# EAGLE design Koala_Bear (EAGLE 6.5.0)
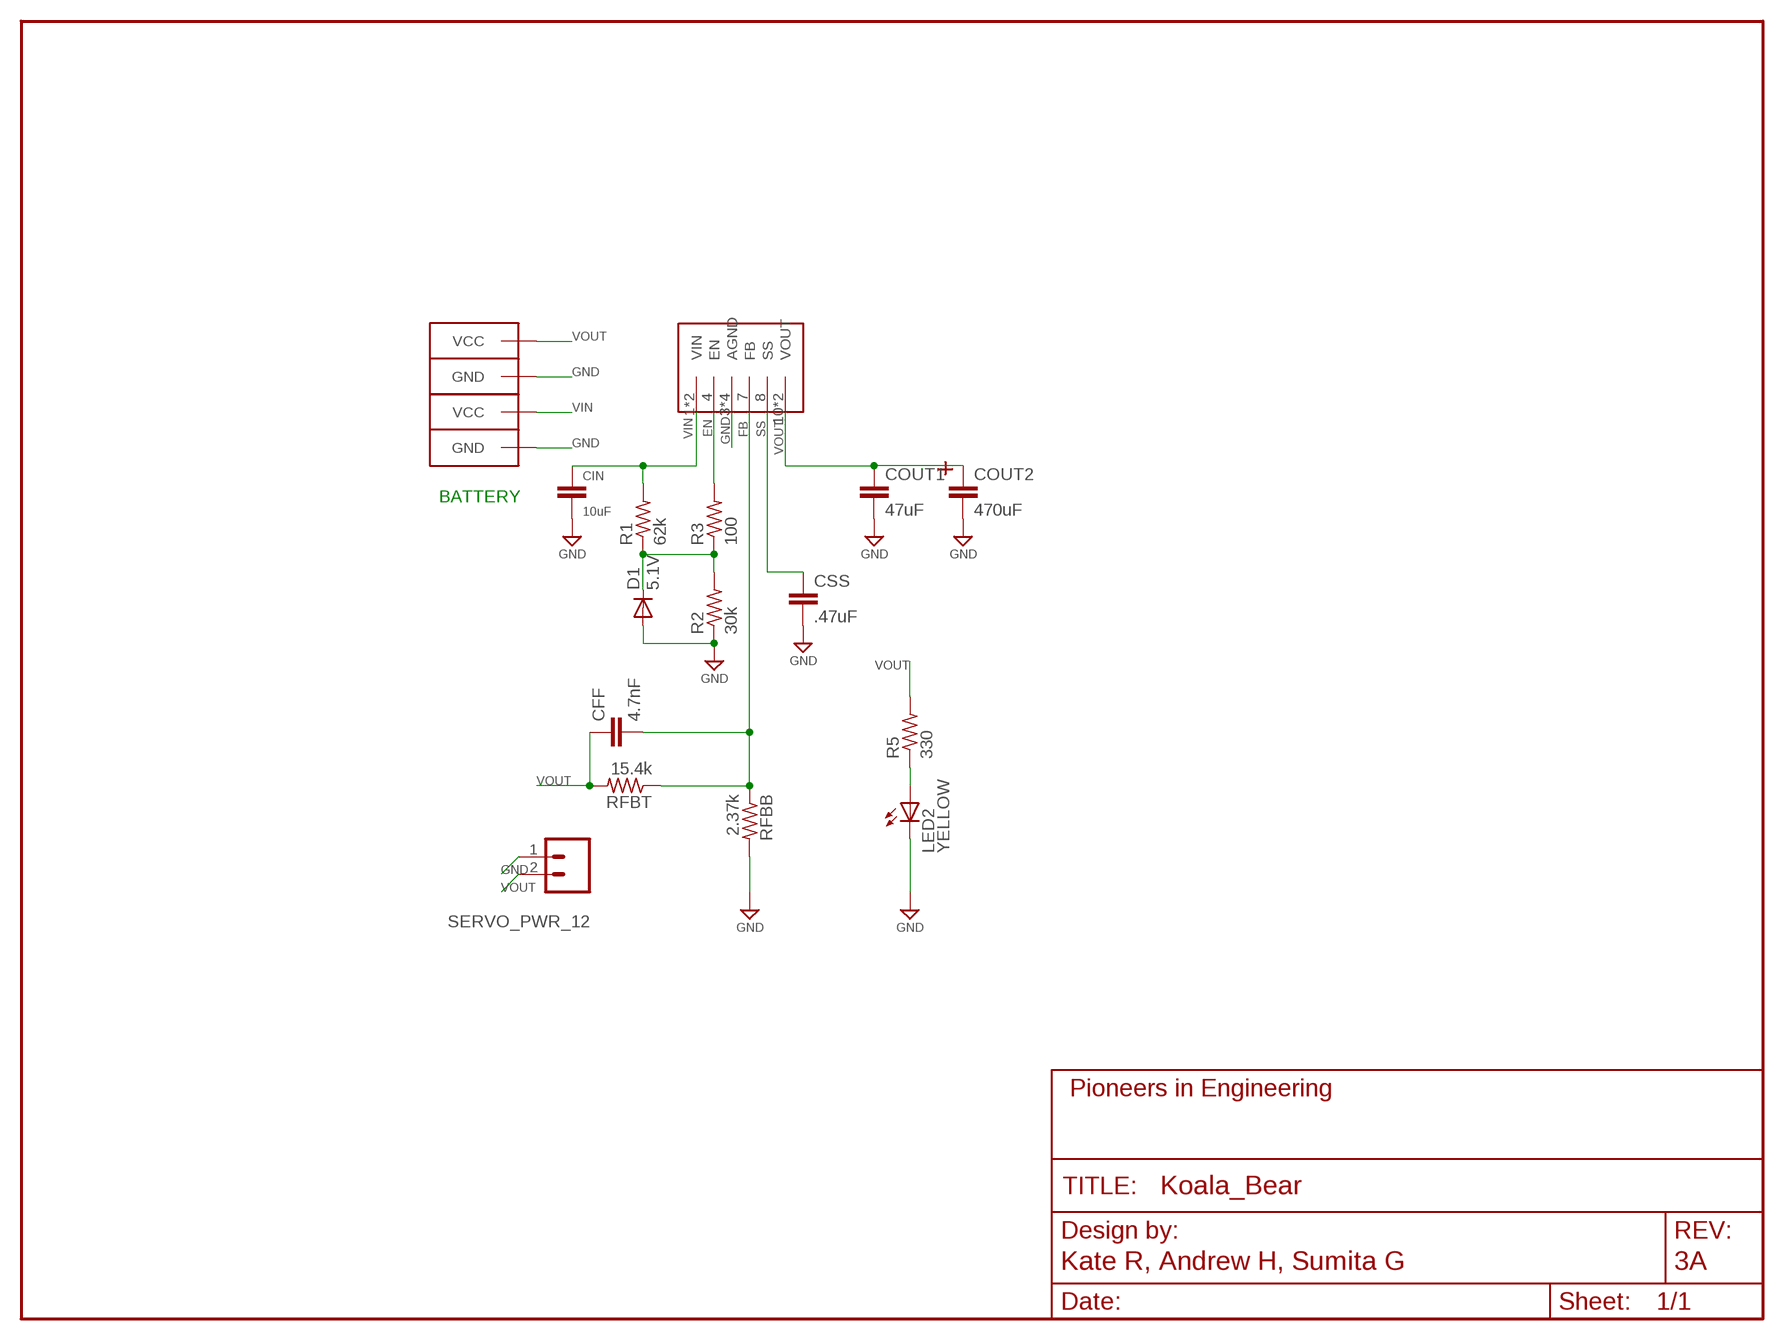
[diagram p0: schematic, sheet 1]
FRAME1 (FRAME-LETTER): AUTHOR: Kate R, Andrew H, Sumita G; REVISION: 3A

## Parts
CFF  4.7nF  CAP0603-CAP  [0603-CAP]
CIN  10uF  CAP1206  [1206]
COUT1  47uF  CAP1206  [1206]
COUT2  470uF  TANT_CASE_E  [TANT_CASE_E]
CSS  .47uF  CAP0603-CAP  [0603-CAP]
D1  5.1V  DIODESOD-323  [SOD-323]
LED2  YELLOW  LED0805  [LED-0805]
PWR  ANDERSONVERTICAL  [ANDERSON_VERTICAL]
PWR1  ANDERSONVERTICAL  [ANDERSON_VERTICAL]
R1  62k  R-US_R0603  [R0603]
R2  30k  R-US_R0603  [R0603]
R3  100  R-US_R0603  [R0603]
R5  330  R-US_R0603  [R0603]
RFBB  2.37k  R-US_R0603  [R0603]
RFBT  15.4k  R-US_R0603  [R0603]
SERVO_PWR_12  M02PTH  [1X02]
U$1  LMZ12010  [LMZ12010]

## Nets
DIODE: D1.2(C) R1.1 R2.2 R3.1
EN: R3.2 U$1.4(EN)
FB: CFF.2 RFBB.1 RFBT.1 U$1.7(FB)
GND: CIN.2 COUT1.2 COUT2.NEG CSS.2 D1.1(A) LED2.C PWR1.PIN1(GND) PWR.PIN1(GND) R2.1 RFBB.2 SERVO_PWR_12.1 U$1.3(AGND) U$1.5(AGND) U$1.6(AGND) U$1.GND(AGND)
N$5: LED2.A R5.1
SS: CSS.1 U$1.8(SS)
VIN: CIN.1 PWR.PIN2(VCC) R1.2 U$1.1(VIN) U$1.2(VIN)
VOUT: CFF.1 COUT1.1 COUT2.POS PWR1.PIN2(VCC) R5.2 RFBT.2 SERVO_PWR_12.2 U$1.10(VOUT) U$1.11(VOUT)

## Notes on the sheet
- BATTERY

## Library data of the parts
CFF CIN COUT1 CSS = pie:CAP: Capacitor Standard 0603 ceramic capacitor, and 0.1" leaded capacitor.; PIE-INT-REF-NUM: CAPACITOR-GENERIC
COUT2 = pie:TANT_CASE_E; PIE-INT-REF-NUM: CAPACITOR-TANTALUM
D1 = pie:DIODE: Diode These are standard reverse protection diodes and small signal diodes. SMA package can handle up to about 1A. SOD-323 can handle about 200mA. What the SOD-323 package when ordering, there are some mfgs out there that are 5-pin packages.; PIE-INT-REF-NUM: DIODE
LED2 = pie:LED: LEDs Standard schematic elements and footprints for 5mm, 3mm, 1206, and 0603 sized LEDs. 5mm - Spark Fun Electronics SKU : COM-00529 (and others); PIE-INT-REF-NUM: LED
PWR PWR1 = pie:ANDERSON: 2-pin 25A Anderson Connector http://www.alliedelec.com/images/products/datasheets/bm/ANDERSON_POWER_PRODUCTS/70162018.pdf; PIE-INT-REF-NUM: Anderson
R1-R3 R5 RFBB RFBT = pie:R-US_: RESISTOR, American symbol; PIE-INT-REF-NUM: RESISTOR-GENERIC
SERVO_PWR_12 = pie:M02: 2-pin 0.1-inch header and MTA connector; PIE-INT-REF-NUM: BULK-STOCK
U$1 = pie:LMZ12010; PIE-INT-REF-NUM: LMZ12010

## Board
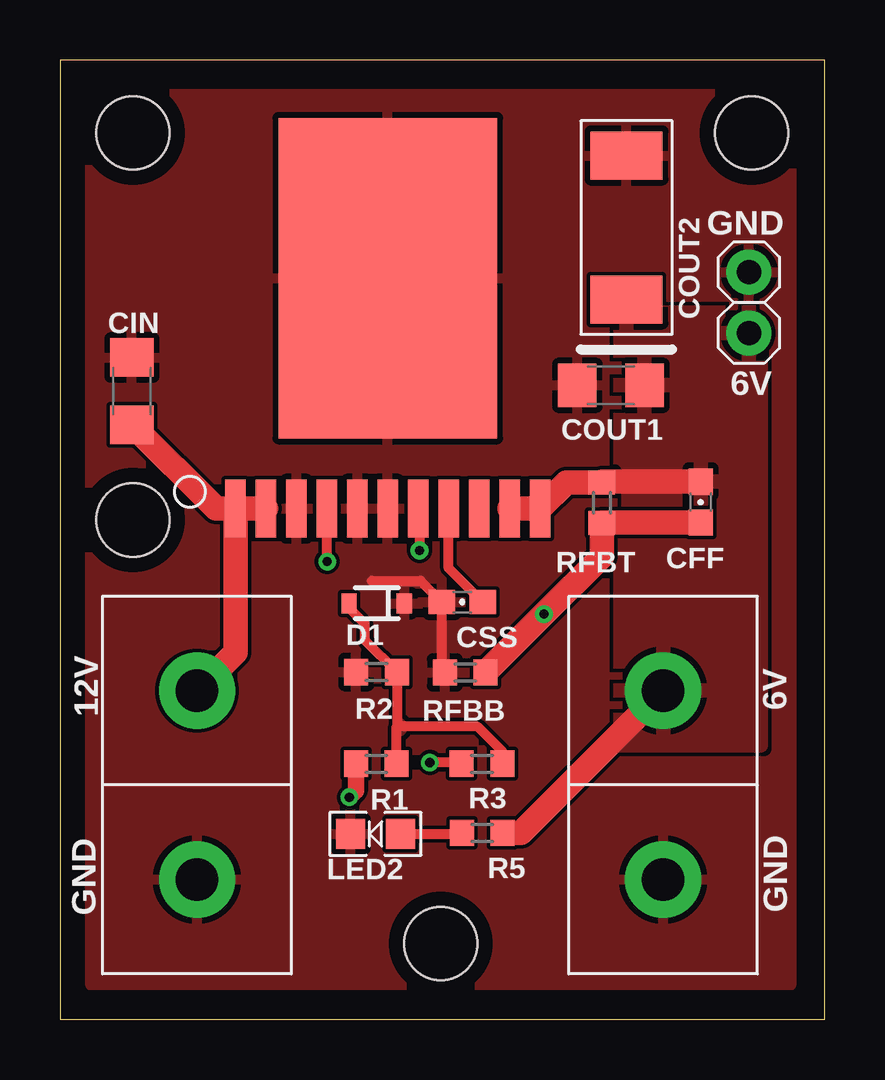
[diagram p1: board, top side]
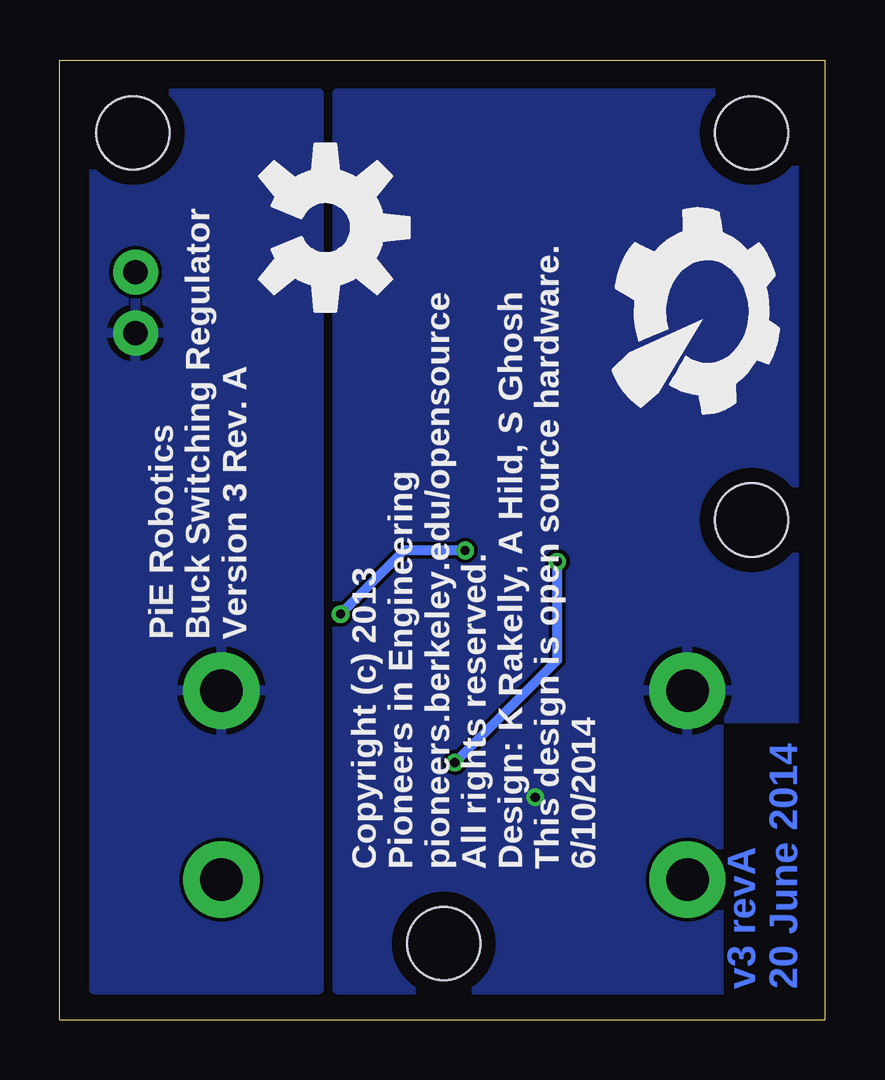
[diagram p2: board, bottom side, seen from below]

Size 31.88 x 40.01 mm. Coordinates in mm from the lower left corner, seen from the top.
Outline: 31.88,0 31.88,40.01 0,40.01 0,0 31.88,0
Copper layers (1*16): Top 2mil / dielectric 9mil / Bottom 2mil
Design rules "advancedcircuits-33each-pie *": minimum track width 6mil, minimum drill 15mil, track to track 6mil, track to pad 10mil, pad to pad 6mil, via to via 6mil, smd to smd 6mil, copper to edge 25mil, drill to drill 7mil, minimum pad ring 7mil, minimum via ring 7mil, stop-mask expansion 3mil, vias tented up to drill 24mil, thermal gap 10mil

### Footprints (pad centres in the part's own frame; a part is rotated, then mirrored left to right if it is on the bottom)
0603-CAP = smd 1.1 x 1: 1 -0.85,0; 2 0.85,0
1206 = smd 1.6 x 1.8: 1 -1.4,0; 2 1.4,0
TANT_CASE_E = smd 2 x 3: NEG 3,0; POS -3,0
SOD-323 = smd 0.63 x 0.83: 1 -1.15,0; 2 1.15,0
LED-0805 = smd 1.194 x 1.245: A -1.041,0; C 1.041,0
ANDERSON_VERTICAL = drill 1.778 pad 3.175: PIN1 0,-3.937; PIN2 0,3.937
R0603 = smd 1 x 1.1: 1 -0.85,0; 2 0.85,0
1X02 = drill 1.016 pad 1.88: 1 -1.27,0; 2 1.27,0
LMZ12010 = smd 0.861 x 2.41: 1 -6.35,-9.601; 2 -5.08,-9.601; 3 -3.81,-9.601; 4 -2.54,-9.601; 5 -1.27,-9.601; 6 0,-9.601; 7 1.27,-9.601; 8 2.54,-9.601; 9 3.81,-9.601; 10 5.08,-9.601; 11 6.35,-9.601 | smd 9.119 x 13.36: GND 0,0
STAND-OFF-TIGHT = hole 3.048: 0,0

### Placement (x,y rotation side)
CFF  26.71,21.58 270 top
CIN  3,26.2 90 top
COUT1  22.97,26.45 180 top
COUT2  23.62,33.02 90 top
CSS  16.77,17.41 180 top
D1  13.21,17.35 180 top
LED2  13.15,7.74 180 top
PWR  5.71,9.78 0 top
PWR1  25.15,9.78 0 top
R1  13.19,10.66 180 top
R2  13.19,14.49 0 top
R3  17.59,10.66 180 top
R5  17.6,7.79 0 top
RFBB  16.9,14.47 180 top
RFBT  22.59,21.54 90 top
SERVO_PWR_12  28.73,29.89 270 top
U$1  13.67,30.9 0 top
U$2  [STAND-OFF-TIGHT]  28.83,36.96 0 top
U$3  [STAND-OFF-TIGHT]  3.05,20.83 0 top
U$4  [STAND-OFF-TIGHT]  3.05,36.96 0 top
U$5  [STAND-OFF-TIGHT]  15.88,3.17 0 top
U$10  [PIE-LOGO-SMALL]  5.06,29.22 270 bottom
U$11  [OSHW-LOGO-L]  20.8,33.02 270 bottom

### Tracks (layer width: path | path; a pad name or v marks a point on that pad's centre or on a via)
DIODE
  Top 0.406: R1.1 14.04,12.21 | 14.04,12.21 17.4,12.21 18.44,11.17 R3.1 | R2.2 14.04,12.22 14.04,12.21 | 14.36,14.8 R2.2 | D1.2 12.06,17.15 12.7,16.51 12.7,15.83 R2.2
  pour Top: 14.22,11.94 14.35,12.06 14.35,12.32 14.22,12.45 13.97,12.45 13.97,11.94
EN  (via drill 0.38)
  Top 0.406: R3.2 16.69,10.71 v15.42,10.71 | v11.14,19.09 11.13,19.11 U$1.4
  Bottom 0.406: v15.42,10.71 11.14,14.99 v11.14,19.09
FB  (via drill 0.38)
  Top 0.406: U$1.7 14.99,21.25 v14.99,19.56
  Top 1.016: CFF.2 22.62,20.73 RFBT.1 22.59,19.31 v20.18,16.91 RFBB.1
  Bottom 0.406: v14.99,19.56 17.53,19.56 v20.18,16.91
GND
  Top 0.406: 16.05,14.56 RFBB.2 15.92,14.6 CSS.2 15.04,18.29 12.99,18.29
  pour Top (rank 2): 1.27,38.61 30.48,38.61 30.48,1.42 1.27,1.42
N$5
  Top 0.406: LED2.A 16.71,7.74 R5.1
SS
  Top 0.406: CSS.1 16.21,18.82 U$1.8
VIN  (via drill 0.38 pad 0.74)
  Top 0.686: R1.2 12.34,9.54 v12.06,9.27
  Top 1.016: U$1.2 U$1.1 | U$1.1 7.32,15.32 PWR.PIN2 | U$1.1 6.5,21.3 CIN.1
  pour Bottom: 1.27,38.61 20.32,38.61 20.32,1.27 1.27,1.27
VOUT
  Top 1.016: R5.2 19.21,7.79 PWR1.PIN2 | U$1.10 U$1.11 21.11,22.39 RFBT.2 22.62,22.43 CFF.1
  pour Bottom: 21.08,38.61 30.48,38.61 30.48,1.27 21.08,1.27
  pour Top: 23.37,29.46 29.21,29.46 29.21,11.43 23.37,11.43

### Text on the board
Bottom: v3 revA / 20 June 2014
tPlace: GND | 6V | 12V | 6V | GND | GND
bPlace: PiE Robotics / Buck Switching Regulator / Version 3 Rev. A | Copyright (c) 2013 / Pioneers in Engineering / pioneers.berkeley.edu/opensource / All rights reserved. / Design: K Rakelly, A Hild, S Ghosh / This design is open source hardware. / 6/10/2014
tValues: 470uF | 10uF | 47uF | 15.4k | 4.7nF | .47uF | 30k | 100 | 2.37k | 60k